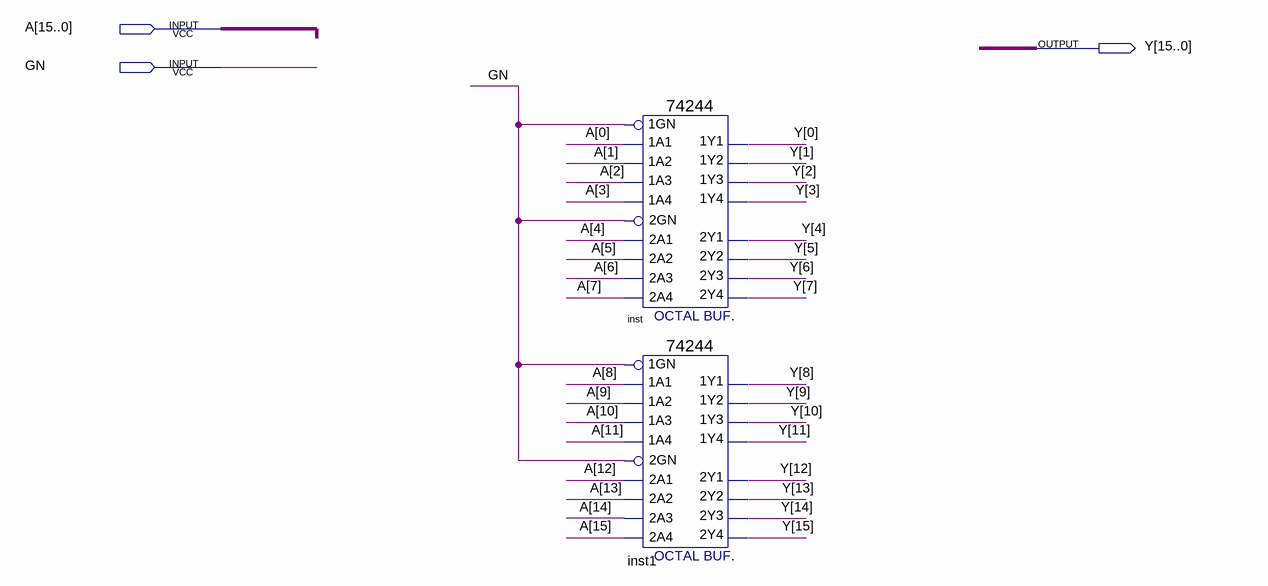
[diagram p0: schematic sheet]
// Quartus schematic 74244_16.bdf as structural Verilog: 2 symbols, 3 pins
module \74244_16  (
  input  [15:0] A,
  input  GN,
  output [15:0] Y
);

  \74244  inst (
    .\1A2 (A[1]), .\1A4 (A[3]), .\1A1 (A[0]), .\1A3 (A[2]), .\1GN (GN), .\2A3 (A[6]), .\2GN (GN),
    .\2A1 (A[4]), .\2A4 (A[7]), .\2A2 (A[5]), .\1Y2 (Y[1]), .\1Y4 (Y[3]), .\2Y1 (Y[4]), .\1Y1 (Y[0]),
    .\2Y3 (Y[6]), .\2Y4 (Y[7]), .\1Y3 (Y[2]), .\2Y2 (Y[5]));
  \74244  inst1 (
    .\1A2 (A[9]), .\1A4 (A[11]), .\1A1 (A[8]), .\1A3 (A[10]), .\1GN (GN), .\2A3 (A[14]), .\2GN (GN),
    .\2A1 (A[12]), .\2A4 (A[15]), .\2A2 (A[13]), .\1Y2 (Y[9]), .\1Y4 (Y[11]), .\2Y1 (Y[12]), .\1Y1 (Y[8]),
    .\2Y3 (Y[14]), .\2Y4 (Y[15]), .\1Y3 (Y[10]), .\2Y2 (Y[13]));
endmodule
